# EAGLE design aamp (EAGLE 7.2.0)
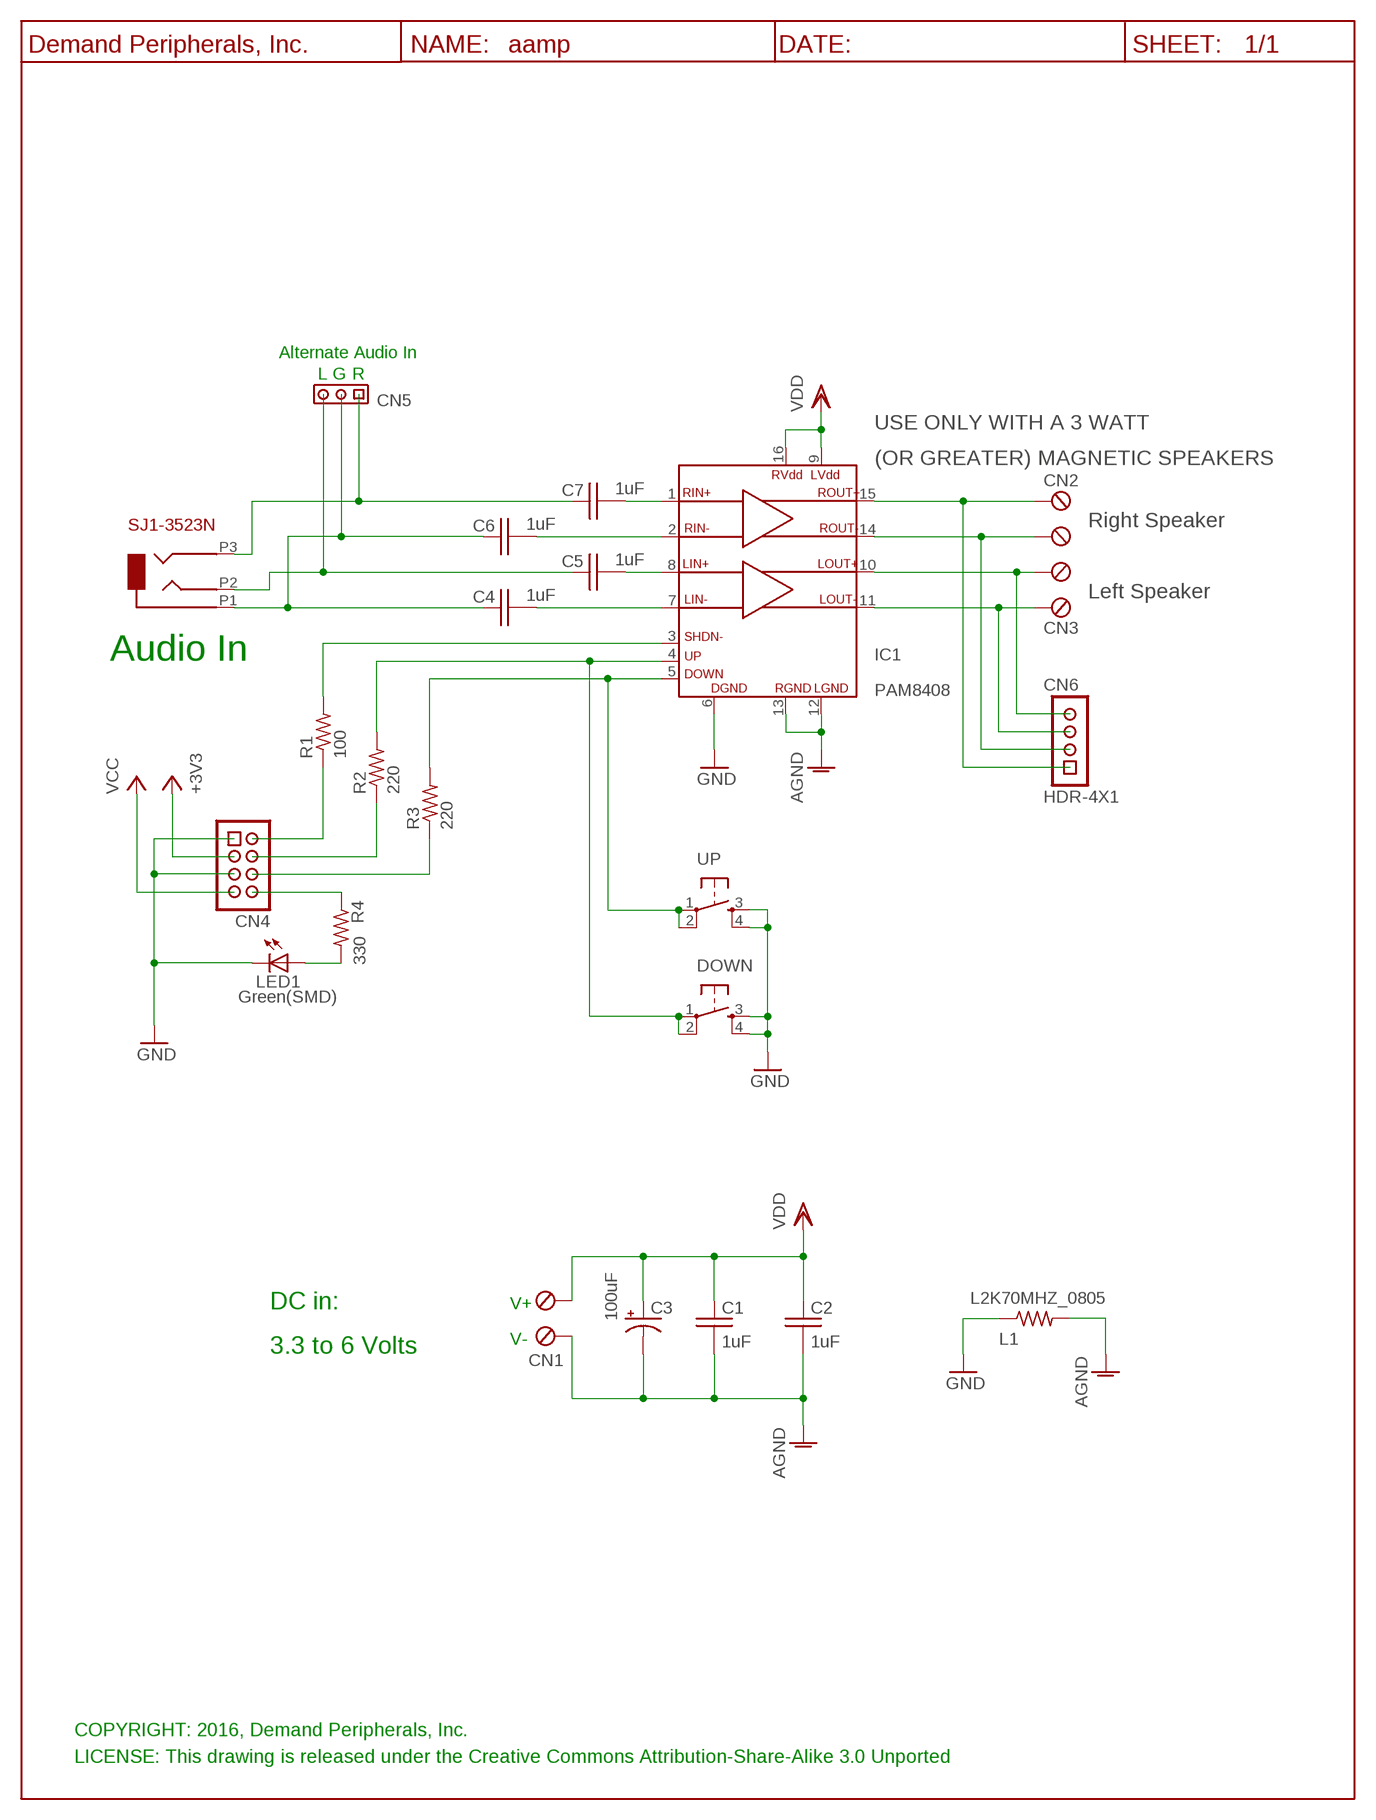
[diagram p0: schematic, sheet 1]

## Parts
AUDIN  SJ1-3523N  [CUI-SJ1-3523N]
C1  1uF  C1.0UF_C0603  [C0603]
C2  1uF  C1.0UF_C0603  [C0603]
C3  100uF  C100UF_E3.5-8  [E3.5-8]
C4  1uF  C1.0UF_C0603  [C0603]
C5  1uF  C1.0UF_C0603  [C0603]
C6  1uF  C1.0UF_C0603  [C0603]
C7  1uF  C1.0UF_C0603  [C0603]
CN1  TBLK-5.08-X2  [TBLK-5.08-X2]
CN2  TBLK-5.08-X2  [TBLK-5.08-X2]
CN3  TBLK-5.08-X2  [TBLK-5.08-X2]
CN4  HDR-4X2-SHR  [HDR-4X2]
CN5  HDR-3X1  [HDR-3X1]
CN6  HDR-4X1  [HDR-4X1]
DOWN  DTSM-6  [DTSM-6]
FRM1  DP_FRAME_P  [P_FRAME]
IC1  PAM8408  [SO16]
L1  L2K70MHZ_0805  L2K70MHZR0805  [R0805]
LED1  Green(SMD)  LED-0603-GRN  [0603]
R1  100  R100_R0603  [R0603]
R2  220  R220_R0603  [R0603]
R3  220  R220_R0603  [R0603]
R4  330  R330_R0603  [R0603]
UP  DTSM-6  [DTSM-6]

## Nets
+3,3V: CN4.3 ; supply symbol labelled +3V3
AGND: C1.2 C2.2 C3.- CN1.1(KL) IC1.12(LGND) IC1.13(RGND) L1.2
GND: CN4.1 CN4.5 DOWN.3 DOWN.4 IC1.6(GND) L1.1 LED1.C UP.3 UP.4
N$1: AUDIN.P1 C4.1 C6.1 CN5.2
N$2: AUDIN.P2 C5.1 CN5.3
N$3: AUDIN.P3 C7.1 CN5.1
N$4: C7.2 IC1.1(RIN+)
N$5: CN4.8 R4.1
N$6: C6.2 IC1.2(RIN-)
N$7: C5.2 IC1.8(LIN+)
N$9: C4.2 IC1.7(LIN-)
N$10: CN4.6 R3.1
N$11: CN4.4 R2.1
N$12: CN4.2 R1.1
N$13: IC1.3(SHDN-) R1.2
N$14: LED1.A R4.2
N$17: DOWN.1 DOWN.2 IC1.4(UP) R2.2
N$18: IC1.5(DOWN) R3.2 UP.1 UP.2
N$19: CN3.2(KL1) CN6.3 IC1.11(LOUT-)
N$22: CN3.1(KL) CN6.4 IC1.10(LOUT+)
N$24: CN2.1(KL) CN6.2 IC1.14(ROUT-)
N$25: CN2.2(KL1) CN6.1 IC1.15(ROUT+)
VCC: CN4.7
VDD: C1.1 C2.1 C3.+ CN1.2(KL1) IC1.9(LVDD) IC1.16(RVDD)

## Notes on the sheet
- Alternate Audio In
- L | G | R
- USE ONLY WITH A 3 WATT
- (OR GREATER) MAGNETIC SPEAKERS
- Right Speaker
- Left Speaker
- Audio In
- DC in: | V+
- V-
- 3.3 to 6 Volts
- COPYRIGHT: 2016, Demand Peripherals, Inc.
- LICENSE: This drawing is released under the Creative Commons Attribution-Share-Alike 3.0 Unported

## Library data of the parts
AUDIN = dpi-conn:SJ1-3523N: 3.5mm Audio Jack; VENDOR: Digikey; VENDOR-PART-NUM: CP1-3523N-ND
C1 C2 C4-C7 = dpi-passive:C1.0UF_: 1.0 uF Capacitor, 25V, Y5V; VENDOR: Digikey; VENDOR-PART-NUM: 490-3897-2-ND
C3 = dpi-passive:C100UF_: 100uF polarized capacitor, general purpose; VENDOR: Digikey; VENDOR-PART-NUM: 1572-1044-ND
CN1-CN3 = dpi-conn:TBLK-5.08-X2: Terminal Block, 5.08mm, x2, screw terminals; VENDOR: Digikey; VENDOR-PART-NUM: ED2609-ND
CN4 = dpi-conn:HDR-4X2-SHR: Shrouded 4x2 pin header; VENDOR: Digikey; VENDOR-PART-NUM: 609-3530-ND
CN5 = dpi-conn:HDR-3X1: 3 pin header on 0.1 inch centers, no shroud, no lock; VENDOR: Digikey; VENDOR-PART-NUM: 952-2264-ND
CN6 = dpi-conn:HDR-4X1: header 4x1; VENDOR: Digikey; VENDOR-PART-NUM: S1012EC-04-ND
DOWN UP = dpi-swsens:DTSM-6: SPST Momentary contact push button
FRM1 = dpi-sym:DP_FRAME_P: Portrait/Letter Document Frame
IC1 = dpi-transic:PAM8408: Diodes Dual Class D Audio Amplifier; VENDOR: Digikey; VENDOR-PART-NUM: PAM8408DRDICT-ND
L1 = dpi-passive:L2K70MHZ: Ferrite filter, 2K Ohm at 70MHz; VENDOR: Digikey; VENDOR-PART-NUM: 1276-6330-1-ND
LED1 = dpi-diopto:LED-0603-GRN: Green LED in 0603 SMD package; VENDOR: Digikey; VENDOR-PART-NUM: 160-1435-6-ND
R1 = dpi-passive:R100_: 100 Ohm resistor, 1%, 0.1 watt; VENDOR: Digikey; VENDOR-PART-NUM: 311-100HRTR-ND
R2 R3 = dpi-passive:R220_: 220 Ohm resistor, 1%, 0.1 watt; VENDOR: Digikey; VENDOR-PART-NUM: 311-220HRTR-ND
R4 = dpi-passive:R330_: 330 Ohm resistor, 1%, 0.1 watt; VENDOR: Digikey; VENDOR-PART-NUM: 311-330HRTR-ND

## Board
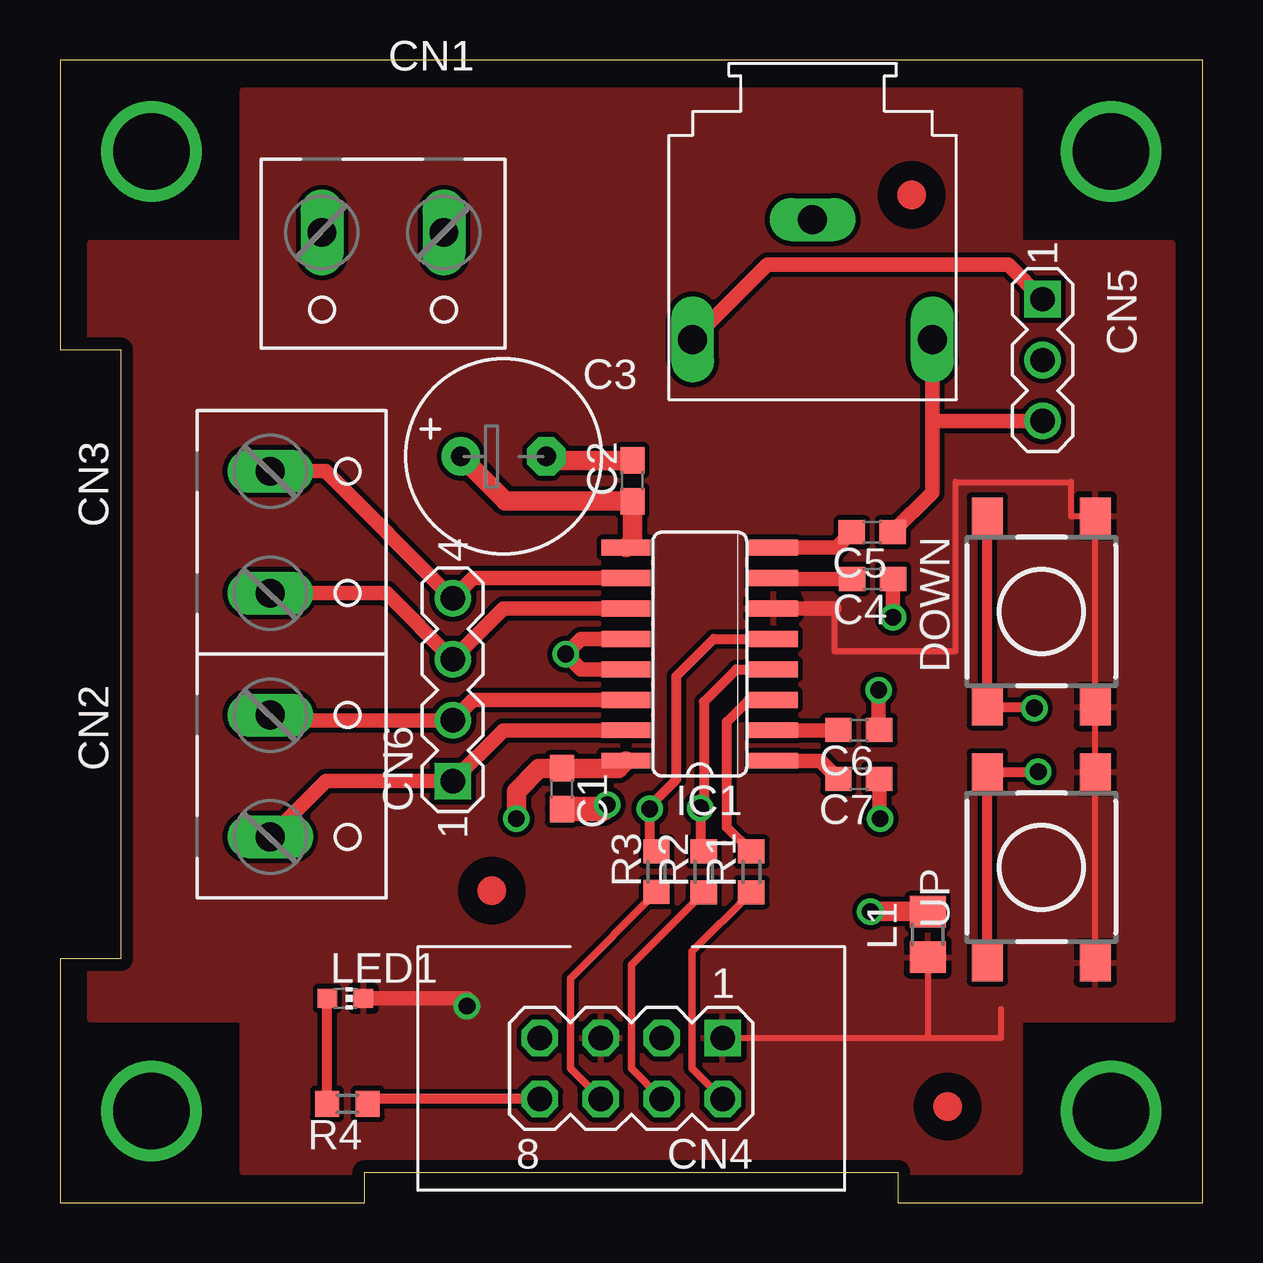
[diagram p1: board, top side]
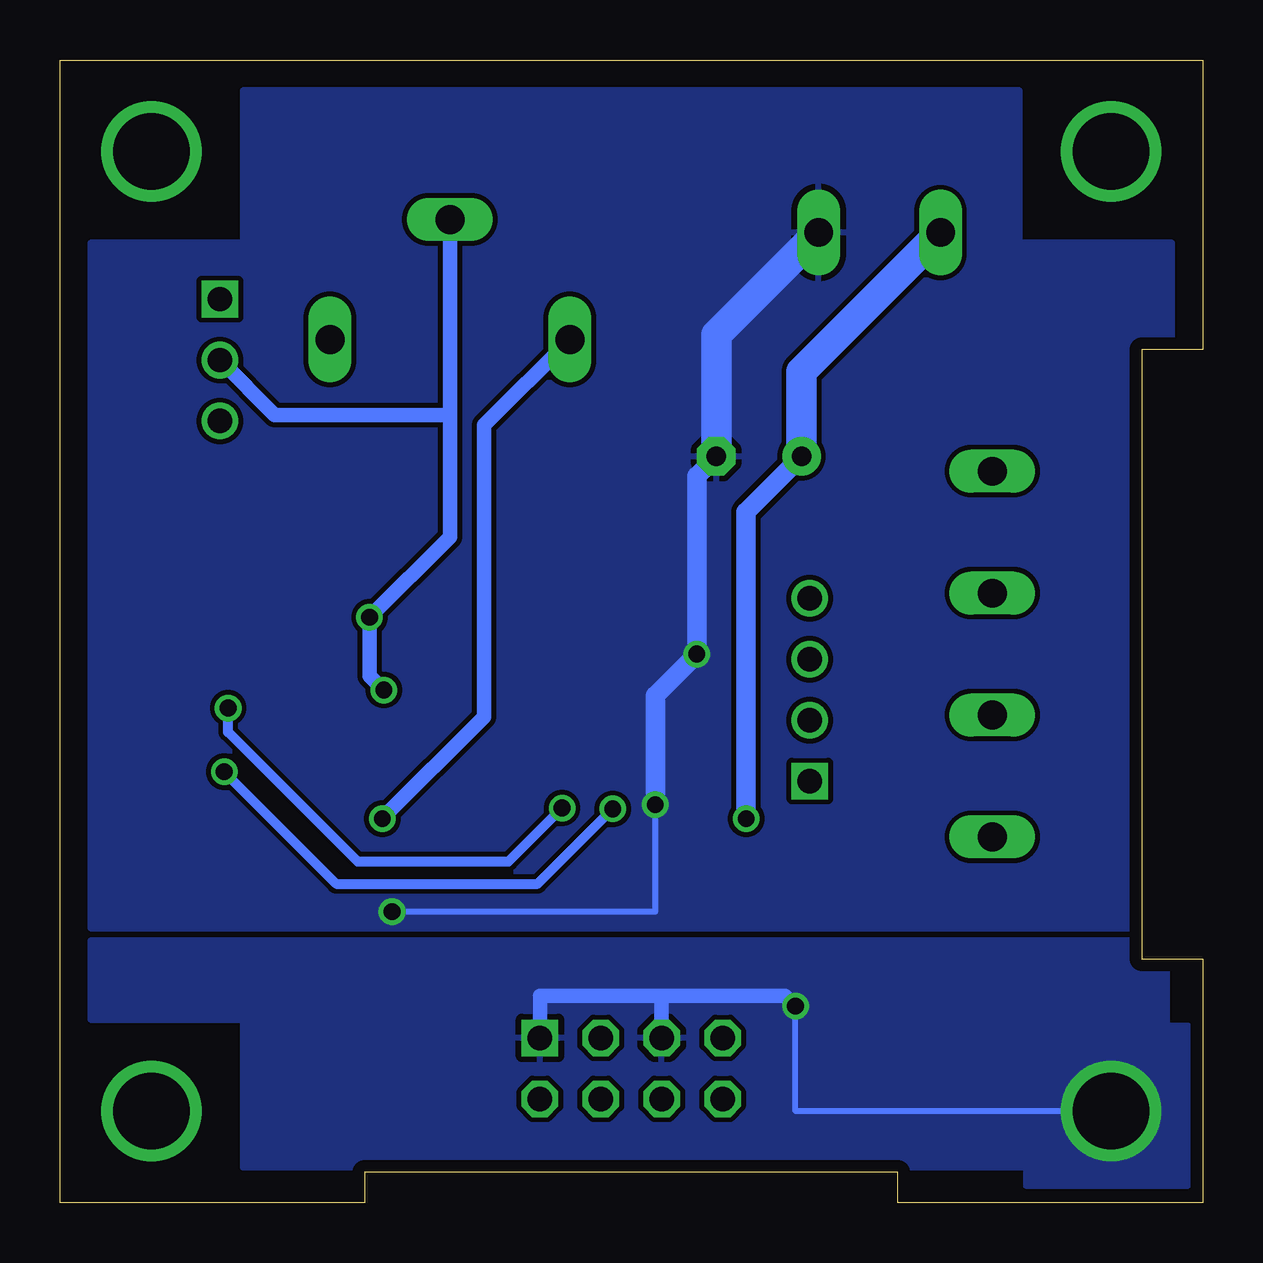
[diagram p2: board, bottom side, seen from below]

Size 47.62 x 47.62 mm. Coordinates in mm from the lower left corner, seen from the top.
Outline: 0,0 12.7,0 12.7,1.27 34.92,1.27 34.92,0 47.62,0 47.62,47.62 0,47.62 0,35.56 2.54,35.56 2.54,10.16 0,10.16 0,0
Copper layers (1*16): Top 0.035mm / dielectric 1.5mm / Bottom 0.035mm
Design rules "default *": minimum track width 10mil, minimum drill 24mil, track to track 8mil, track to pad 8mil, pad to pad 8mil, via to via 8mil, smd to smd 8mil, copper to edge 20mil, drill to drill 12mil, minimum pad ring 10mil, minimum via ring 8mil, stop-mask expansion 4mil, vias tented up to drill 50mil, thermal gap 10mil

### Footprints (pad centres in the part's own frame; a part is rotated, then mirrored left to right if it is on the bottom)
CUI-SJ1-3523N = drill 1.2 long: P1 -0.5,0; P2 4.5,5; P3 4.5,-5
C0603 = smd 1.1 x 1: 1 -0.85,0; 2 0.85,0
E3.5-8 = drill 0.813 pad 1.6: + -1.778,0 | drill 0.813 pad 1.6 octagon: - 1.778,0
TBLK-5.08-X2 = drill 1.194 long: 1 -2.54,-0.127; 2 2.54,-0.127
HDR-4X2 = drill 1.016 square: 1 -3.81,-1.27 | drill 1.016 octagon: 2 -3.81,1.27; 3 -1.27,-1.27; 4 -1.27,1.27; 5 1.27,-1.27; 6 1.27,1.27; 7 3.81,-1.27; 8 3.81,1.27
HDR-3X1 = drill 1.016 square: 1 -2.54,0 | drill 1.016: 2 0,0; 3 2.54,0
HDR-4X1 = drill 1.016 square: 1 -3.81,0 | drill 1.016: 2 -1.27,0; 3 1.27,0; 4 3.81,0
DTSM-6 = smd 1.55 x 1.3: 1 -3.975,2.25; 2 3.975,2.25; 3 -3.975,-2.25; 4 3.975,-2.25
SO16 = smd 0.66 x 2.032: 1 -4.445,-3.073; 2 -3.175,-3.073; 3 -1.905,-3.073; 4 -0.635,-3.073; 5 0.635,-3.073; 6 1.905,-3.073; 7 3.175,-3.073; 8 4.445,-3.073; 9 4.445,3.073; 10 3.175,3.073; 11 1.905,3.073; 12 0.635,3.073; 13 -0.635,3.073; 14 -1.905,3.073; 15 -3.175,3.073; 16 -4.445,3.073
R0805 = smd 1.3 x 1.5: 1 -0.95,0; 2 0.95,0
0603 = smd 0.8 x 0.8: A 0,-0.75; C 0,0.75
R0603 = smd 1 x 1.1: 1 -0.85,0; 2 0.85,0

### Placement (x,y rotation side)
AUDIN  31.37,40.47 270 top
C1  20.92,17.25 270 top
C2  23.86,30.09 90 top
C3  18.49,31.1 0 top
C4  33.87,26 180 top
C5  33.86,27.94 180 top
C6  33.3,19.7 180 top
C7  33.3,17.67 180 top
CN1  13.46,40.31 180 top
CN2  8.89,17.78 270 top
CN3  8.89,27.94 270 top
CN4  23.81,5.59 180 top
CN5  40.96,35.12 270 top
CN6  16.37,21.37 90 top
DOWN  40.91,24.64 90 top
FRM1  -2.54,-2.54 0 top
IC1  26.67,22.86 90 top
L1  36.17,11.18 90 top
LED1  11.9,8.51 270 top
R1  28.82,13.78 90 top
R2  26.84,13.78 90 top
R3  24.87,13.79 90 top
R4  11.98,4.11 180 top
U$1  [DPI-2]  41.91,26.67 270 bottom
U$3  [FIDUCIAL]  37,4 270 top
U$4  [FIDUCIAL]  18,13 270 top
U$6  [FIDUCIAL]  35.5,42 270 top
UP  40.91,13.97 90 top

### Tracks (layer width: path | path; a pad name or v marks a point on that pad's centre or on a via)
AGND  (via drill 0.7)
  Top 0.61: IC1.12 21.72,23.5 v21.08,22.86 21.72,22.23 IC1.13
  Top 0.813: C3.- 20.43,30.94 C2.2 | L1.2 v33.78,12.13 arc-90 v33.78,12.13
  Top 1.016: C1.2 22.62,16.4 v22.81,16.59
  Bottom 0.254: v33.78,12.13 22.81,12.13 v22.81,16.59
  Bottom 0.813: C3.- 21.08,30.29 v21.08,22.86 22.81,21.13 v22.81,16.59
  Bottom 1.27: CN1.1 20.27,36.17 C3.-
  pour Bottom: 1.27,40.01 7.62,40.01 7.62,46.35 40.01,46.35 40.01,40.01 46.35,40.01 46.35,11.43 1.27,11.43
GND  (via drill 0.7, 3.17)
  Top 0.254: CN4.1 36.17,6.86 | 36.17,6.86 39.23,6.86 39.23,8.06 | UP.3 UP.4 DOWN.3 DOWN.4 42.14,28.61 42.14,30.04 37.34,30.04 37.34,22.99 32.28,22.99 32.28,24.77 | L1.1 36.17,6.86
  Top 0.61: LED1.C 16.97,8.51 v16.97,8.19 | IC1.6 32.28,24.77
  Bottom 0.254: v3.81,3.81 16.97,3.81 v16.97,8.19
  Bottom 0.61: CN4.5 22.54,8.62 | 22.54,8.62 27.62,8.62 CN4.1 | v16.97,8.19 17.4,8.62 22.54,8.62
  pour Top: 1.27,40.01 7.62,40.01 7.62,46.35 40.01,46.35 40.01,40.01 46.35,40.01 46.35,7.62 40.01,7.62 40.01,1.27 7.62,1.27 7.62,7.62 1.27,7.62
  pour Bottom: 1.46,10.92 46.35,10.92 46.35,7.62 40.01,7.62 40.01,1.46 7.37,1.46 7.37,0.7 0.6,0.7 0.6,7.37 1.46,7.37
MOUNT2  (via drill 3.17)
  other vias: 43.81,43.81
MOUNT3  (via drill 3.17)
  other vias: 43.81,3.81
MOUNT4  (via drill 3.17)
  other vias: 3.81,43.81
N$1  (via drill 0.7)
  Top 0.61: v34.72,24.4 C4.1 | C6.1 34.12,19.7 v34.12,21.36
  Bottom 0.61: AUDIN.P1 31.37,32.83 | CN5.2 38.67,32.83 31.37,32.83 | 31.37,32.83 31.37,27.75 v34.72,24.4 34.72,21.96 v34.12,21.36
N$2
  Top 0.61: AUDIN.P2 36.37,32.52 | CN5.3 36.42,32.58 36.37,32.52 | 36.37,32.52 36.37,29.6 C5.1
N$3  (via drill 0.7)
  Top 0.61: AUDIN.P3 29.48,39.09 39.52,39.09 CN5.1 | C7.1 34.15,16.04 v34.19,16
  Bottom 0.61: AUDIN.P3 29.95,32.4 29.95,20.24 v34.19,16
N$4
  Top 0.61: IC1.1 31.7,18.41 C7.2
N$5
  Top 0.406: CN4.8 13.03,4.32 R4.1
N$6
  Top 0.61: IC1.2 32.44,19.68 C6.2
N$7
  Top 0.61: C5.2 32.37,27.3 IC1.8
N$9
  Top 0.61: 32.98,26.04 C4.2 29.78,26 IC1.7
N$10
  Top 0.305: CN4.6 21.27,5.59 21.27,7.61 21.27,9.35 R3.1
N$11
  Top 0.305: CN4.4 23.81,5.59 23.81,7.59 23.81,9.91 R2.1
N$12
  Top 0.305: CN4.2 26.35,5.59 26.35,7.61 26.35,10.47 R1.1
N$13
  Top 0.406: R1.2 27.8,15.65 27.8,20.04 28.71,20.95 IC1.3
N$14
  Top 0.406: R4.2 11.13,8.48 LED1.A
N$17  (via drill 0.7)
  Top 0.406: IC1.4 28.19,22.23 26.84,20.87 26.84,16.59 v26.7,16.45 26.7,14.77 R2.2 | DOWN.2 DOWN.1 40.56,20.66 v40.62,20.61
  Bottom 0.406: v26.7,16.45 28.93,14.21 35.22,14.21 40.62,19.61 v40.62,20.61
N$18  (via drill 0.7)
  Top 0.406: IC1.5 27.24,23.5 25.69,21.95 25.69,17.64 24.59,16.54 v24.59,16.41 24.59,14.92 R3.2 | v40.78,17.96 40.77,17.95 UP.2 UP.1
  Bottom 0.406: 40.42,17.96 v40.78,17.96 36.11,13.28 27.71,13.28 v24.59,16.41
N$19
  Top 0.61: IC1.11 18.49,24.77 CN6.3 13.61,25.4 CN3.2
N$22
  Top 0.61: IC1.10 17.22,26.04 CN6.4 11.07,30.48 CN3.1
N$24
  Top 0.61: IC1.14 17.22,20.95 CN6.2 8.98,20.1 CN2.1
N$25
  Top 0.61: IC1.15 18.49,19.68 CN6.1 11.09,17.56 CN2.2
VDD  (via drill 0.7)
  Top 0.813: C3.+ 18.58,29.24 C2.1 23.86,27.57 IC1.9 | IC1.16 23.28,18.1 C1.1 19.98,18.1 19.02,17.14 v19.02,16
  Bottom 0.813: 16.84,30.98 19.02,28.79 v19.02,16
  Bottom 1.016: 16.84,30.98 C3.+
  Bottom 1.27: CN1.2 16.71,34.65 C3.+

### Text on the board
tTest: 1.875 Inches | 1.575 Inches | +5 | G | LEFT | R | C3 | G | L | Audio In | + | C2 | C5 | C4 | DOWN | C6 | IC1 | C7 | 1.575 Inches | 1.875 Inches | RIGHT | C1 | L1 | UP | R3 | R2 | R1 | AAMP, Rev 19A | LED | BB4 | R4
bTest: (C) 2019, Demand Peripherals, Inc.